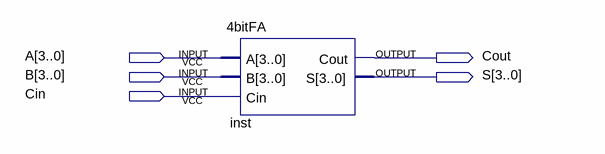
[diagram p0: schematic sheet]
// Quartus schematic L0601.bdf as structural Verilog: 1 symbols, 5 pins
module L0601 (
  input  [3:0] A,
  input  [3:0] B,
  input  Cin,
  output Cout,
  output [3:0] S
);

  \4bitFA  inst (.A(A), .B(B), .Cin(Cin), .Cout(Cout), .S(S));
endmodule
